# Altium schematic sheet AM3359_C.SchDoc
size A2
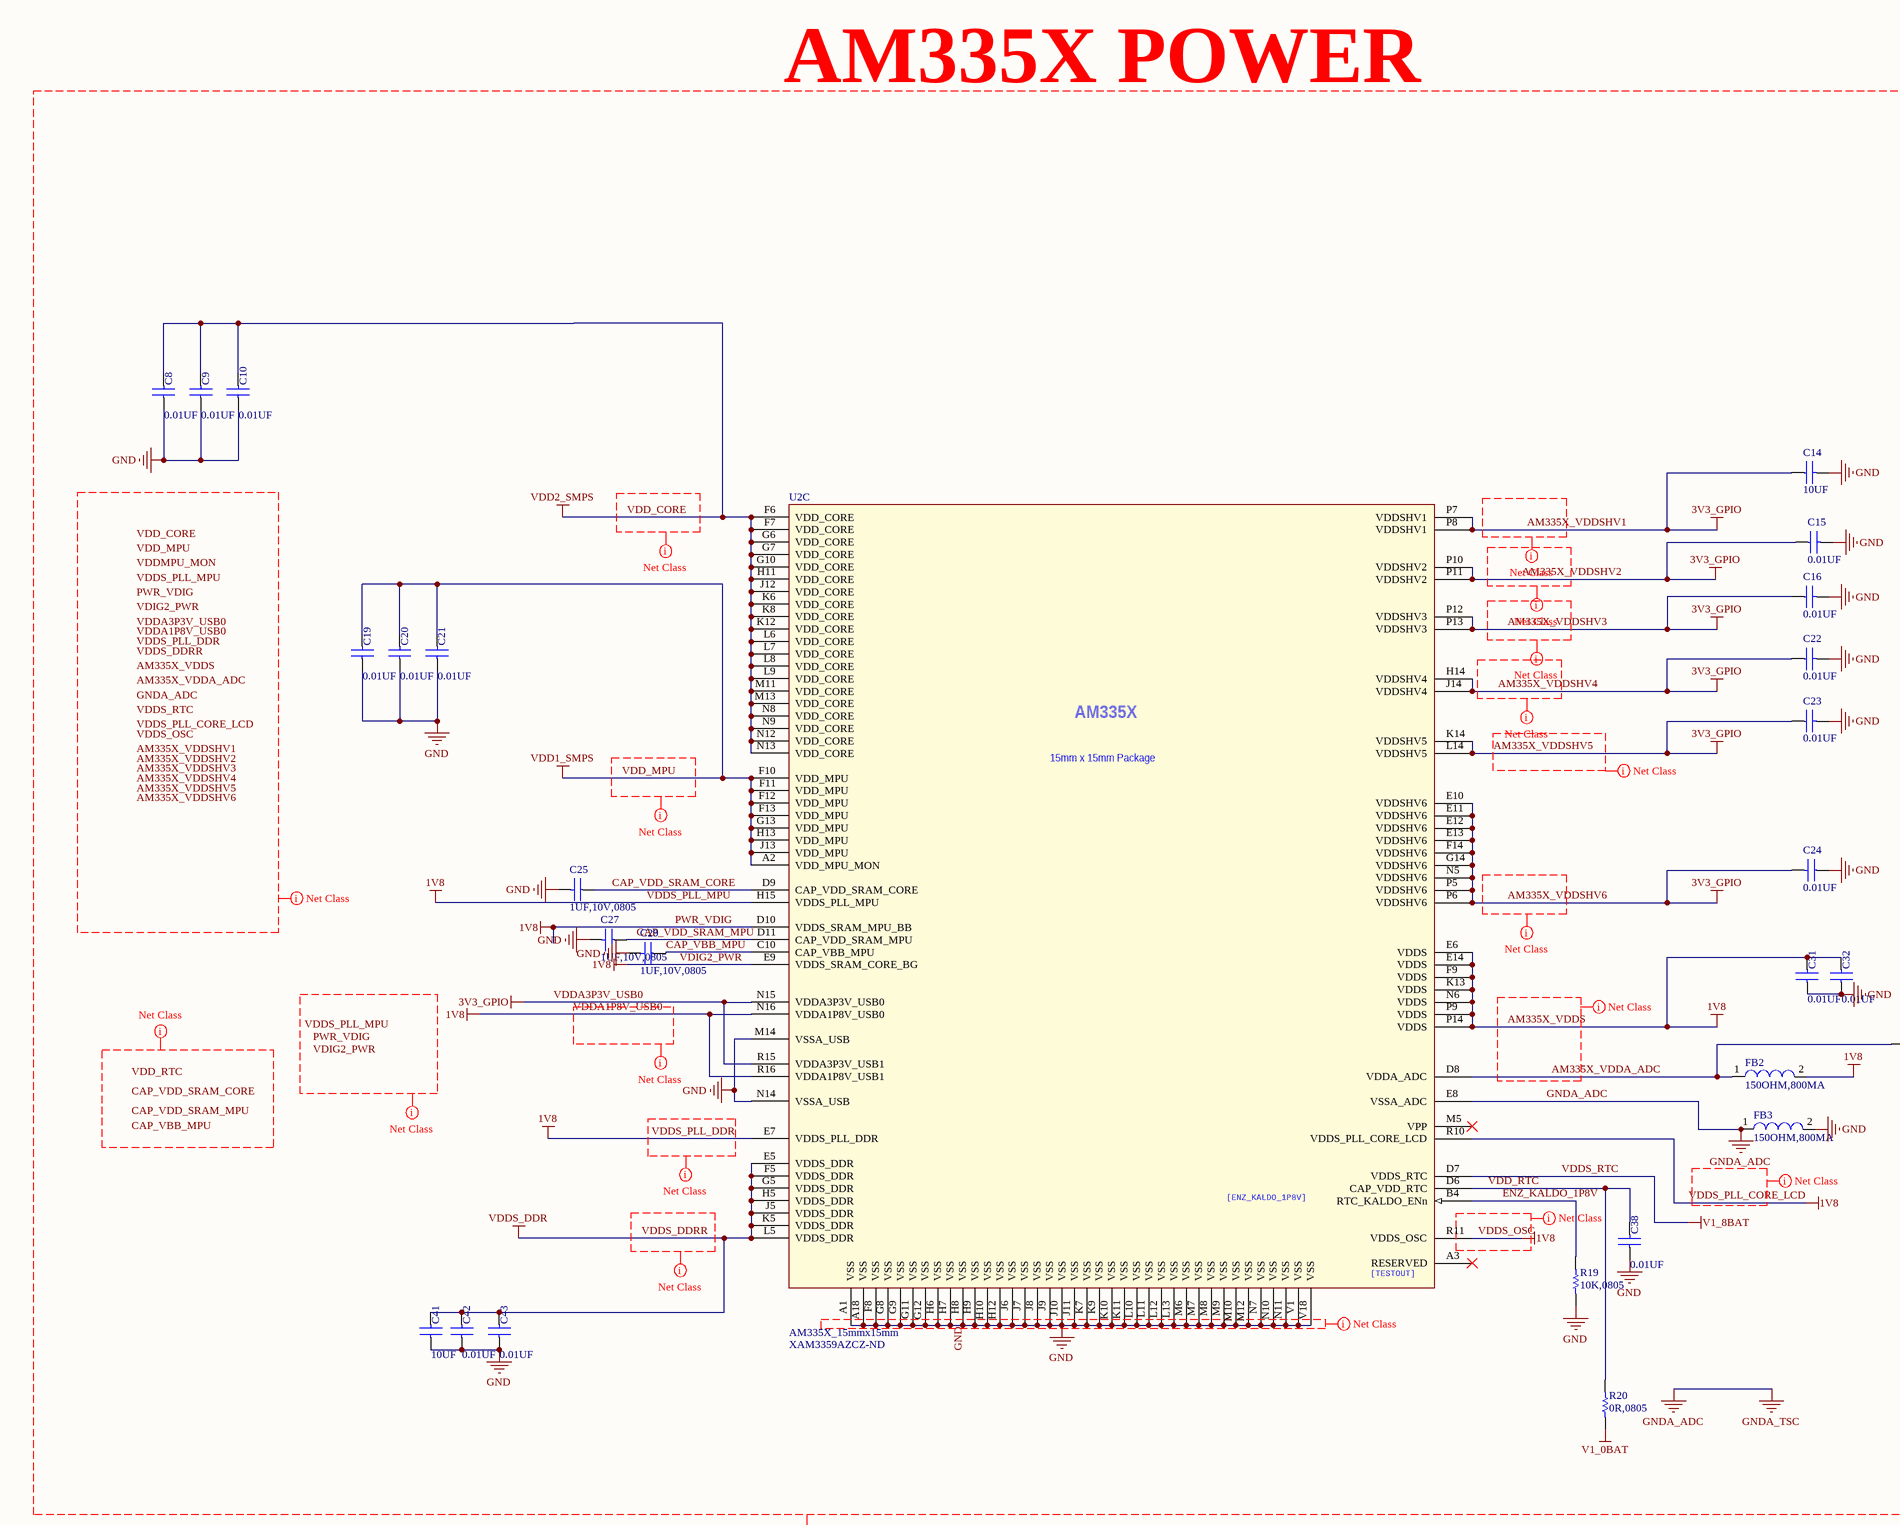
[diagram p0: AM3359_C.SchDoc, left]
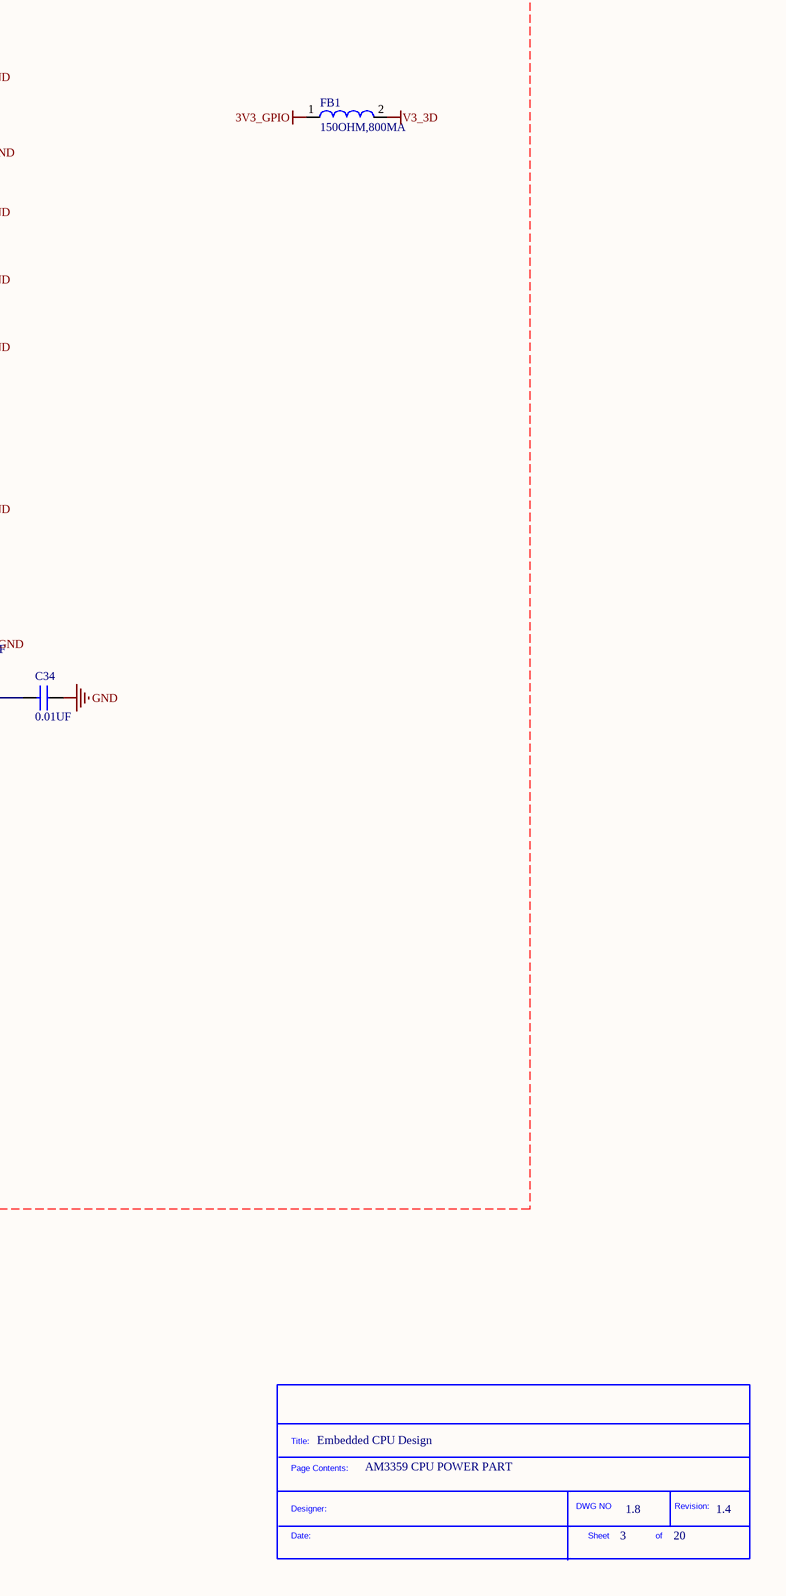
[diagram p1: AM3359_C.SchDoc, right]

## Parts
*?  SDTitleBlock  (value not drawn)  (graphical)
C8  0.01UF  [0402]
C9  0.01UF  [0402]
C10  0.01UF  [0402]
C14  10UF  [0402]
C15  0.01UF  [0402]
C16  0.01UF  [0402]
C19  0.01UF  [0402]
C20  0.01UF  [0402]
C21  0.01UF  [0402]
C22  0.01UF  [0402]
C23  0.01UF  [0402]
C24  0.01UF  [0402]
C25  1UF,10V,0805  [0402]
C27  1UF,10V,0805  [0402]
C29  1UF,10V,0805  [0402]
C31  0.01UF  [0402]
C32  0.01UF  [0402]
C34  0.01UF  [0402]
C38  0.01UF  [0402]
C41  10UF  [0402]
C42  0.01UF  [0402]
C43  0.01UF  [0402]
FB1  150OHM,800MA  [0805]
FB2  150OHM,800MA  [0805]
FB3  150OHM,800MA  [0805]
R19  10K,0805  [0402]
R20  0R,0805  [0402]
U2  AM335X_15mmx15mm  Supplier Part Number 1: XAM3359AZCZ-ND  [am33xx_15x15]  (part C of 3)

## Nets
AM335X_VDDS: C31.2 C32.2 FB2.2 U2.D10(VDDS_SRAM_MPU_BB) U2.E6(VDDS) U2.E7(VDDS_PLL_DDR) U2.E9(VDDS_SRAM_CORE_BG) U2.E14(VDDS) U2.F9(VDDS) U2.H15(VDDS_PLL_MPU) U2.K13(VDDS) U2.N6(VDDS) U2.N16(VDDA1P8V_USB0) U2.P9(VDDS) U2.P14(VDDS) U2.R10(VDDS_PLL_CORE_LCD) U2.R11(VDDS_OSC) U2.R16(VDDA1P8V_USB1)  [also labelled 1V8, PWR_VDIG, VDDA1P8V_USB0, VDDS_OSC, VDDS_PLL_CORE_LCD, VDDS_PLL_DDR, VDDS_PLL_MPU, VDIG2_PWR]
AM335X_VDDSHV1: C14.1 C15.1 C16.1 C22.1 C23.1 C24.2 FB1.1 U2.E10(VDDSHV6) U2.E11(VDDSHV6) U2.E12(VDDSHV6) U2.E13(VDDSHV6) U2.F14(VDDSHV6) U2.G14(VDDSHV6) U2.H14(VDDSHV4) U2.J14(VDDSHV4) U2.K14(VDDSHV5) U2.L14(VDDSHV5) U2.N5(VDDSHV6) U2.N15(VDDA3P3V_USB0) U2.P5(VDDSHV6) U2.P6(VDDSHV6) U2.P7(VDDSHV1) U2.P8(VDDSHV1) U2.P10(VDDSHV2) U2.P11(VDDSHV2) U2.P12(VDDSHV3) U2.P13(VDDSHV3) U2.R15(VDDA3P3V_USB1)  [also labelled 3V3_GPIO, AM335X_VDDSHV2, AM335X_VDDSHV3, AM335X_VDDSHV4, AM335X_VDDSHV5, AM335X_VDDSHV6, VDDA3P3V_USB0]
GND: C8.1 C9.1 C10.1 C14.2 C15.2 C16.2 C19.1 C20.1 C21.1 C22.2 C23.2 C24.1 C25.2 C27.2 C29.2 C31.1 C32.1 C34.1 C38.1 C41.1 C42.1 C43.1 FB3.2 R19.1 U2.A1(VSS) U2.A18(VSS) U2.F8(VSS) U2.G8(VSS) U2.G9(VSS) U2.G11(VSS) U2.G12(VSS) U2.H6(VSS) U2.H7(VSS) U2.H8(VSS) U2.H9(VSS) U2.H10(VSS) U2.H12(VSS) U2.J6(VSS) U2.J7(VSS) U2.J8(VSS) U2.J9(VSS) U2.J10(VSS) U2.J11(VSS) U2.K7(VSS) U2.K9(VSS) U2.K10(VSS) U2.K11(VSS) U2.L10(VSS) U2.L11(VSS) U2.L12(VSS) U2.L13(VSS) U2.M6(VSS) U2.M7(VSS) U2.M8(VSS) U2.M9(VSS) U2.M10(VSS) U2.M12(VSS) U2.M14(VSSA_USB) U2.N7(VSS) U2.N10(VSS) U2.N11(VSS) U2.N14(VSSA_USB) U2.V1(VSS) U2.V18(VSS)
GNDA_ADC: FB3.1 U2.E8(VSSA_ADC)  [also labelled GNDA_TSC]
V1_0BAT: R20.1
V3_3D: FB1.2
VDD_CORE: C8.2 C9.2 C10.2 U2.F6(VDD_CORE) U2.F7(VDD_CORE) U2.G6(VDD_CORE) U2.G7(VDD_CORE) U2.G10(VDD_CORE) U2.H11(VDD_CORE) U2.J12(VDD_CORE) U2.K6(VDD_CORE) U2.K8(VDD_CORE) U2.K12(VDD_CORE) U2.L6(VDD_CORE) U2.L7(VDD_CORE) U2.L8(VDD_CORE) U2.L9(VDD_CORE) U2.M11(VDD_CORE) U2.M13(VDD_CORE) U2.N8(VDD_CORE) U2.N9(VDD_CORE) U2.N12(VDD_CORE) U2.N13(VDD_CORE)  [also labelled VDD2_SMPS]
VDD_MPU: C19.2 C20.2 C21.2 U2.A2(VDD_MPU_MON) U2.F10(VDD_MPU) U2.F11(VDD_MPU) U2.F12(VDD_MPU) U2.F13(VDD_MPU) U2.G13(VDD_MPU) U2.H13(VDD_MPU) U2.J13(VDD_MPU)  [also labelled VDD1_SMPS]
VDDS_DDRR: C41.2 C42.2 C43.2 U2.E5(VDDS_DDR) U2.F5(VDDS_DDR) U2.G5(VDDS_DDR) U2.H5(VDDS_DDR) U2.J5(VDDS_DDR) U2.K5(VDDS_DDR) U2.L5(VDDS_DDR)  [also labelled VDDS_DDR]
VDDS_RTC: U2.D7(VDDS_RTC)  [also labelled V1_8BAT]
AM335X_VDDA_ADC: C34.2 FB2.1 U2.D8(VDDA_ADC)
CAP_VBB_MPU: C29.1 U2.C10(CAP_VBB_MPU)
CAP_VDD_SRAM_CORE: C25.1 U2.D9(CAP_VDD_SRAM_CORE)
CAP_VDD_SRAM_MPU: C27.1 U2.D11(CAP_VDD_SRAM_MPU)
ENZ_KALDO_1P8V: R19.2 U2.B4(RTC_KALDO_ENn)
VDD_RTC: C38.2 R20.2 U2.D6(CAP_VDD_RTC)

Not connected (* = marked no-connect by the designer): U2 A3(RESERVED)* M5(VPP)*

## Layout directives
net class VDD1_SMPS: VDD_MPU
net class VDD2_SMPS: VDD_CORE
net class VDDS_DDR: VDDS_DDRR
net class 3V3_GPIO_AM335X: 1V8, 3V3_GPIO, AM335X_VDDA_ADC, AM335X_VDDS, AM335X_VDDSHV1, AM335X_VDDSHV2, AM335X_VDDSHV3, AM335X_VDDSHV4, AM335X_VDDSHV5, AM335X_VDDSHV6, CAP_VBB_MPU, CAP_VDD_SRAM_CORE, CAP_VDD_SRAM_MPU, ENZ_KALDO_1P8V, GND, GNDA_ADC, GNDA_TSC, PWR_VDIG, V1_0BAT, V1_8BAT, V3_3D, VDD1_SMPS, VDD2_SMPS, VDD_CORE, VDD_MPU, VDD_RTC, VDDA1P8V_USB0, VDDA3P3V_USB0, VDDMPU_MON, VDDS_DDR, VDDS_DDRR, VDDS_OSC, VDDS_PLL_CORE_LCD, VDDS_PLL_DDR, VDDS_PLL_MPU, VDDS_RTC, VDIG2_PWR
net class 1V8_GPIO_AM335X: 1V8, 3V3_GPIO, AM335X_VDDA_ADC, AM335X_VDDS, AM335X_VDDSHV1, AM335X_VDDSHV2, AM335X_VDDSHV3, AM335X_VDDSHV4, AM335X_VDDSHV5, AM335X_VDDSHV6, CAP_VBB_MPU, CAP_VDD_SRAM_CORE, CAP_VDD_SRAM_MPU, ENZ_KALDO_1P8V, GND, GNDA_ADC, GNDA_TSC, PWR_VDIG, V1_0BAT, V1_8BAT, V3_3D, VDD1_SMPS, VDD2_SMPS, VDD_CORE, VDD_MPU, VDD_RTC, VDDA1P8V_USB0, VDDA3P3V_USB0, VDDMPU_MON, VDDS_DDR, VDDS_DDRR, VDDS_OSC, VDDS_PLL_CORE_LCD, VDDS_PLL_DDR, VDDS_PLL_MPU, VDDS_RTC, VDIG2_PWR
net class AM335X_C: 1V8, 3V3_GPIO, AM335X_VDDA_ADC, AM335X_VDDS, AM335X_VDDSHV1, AM335X_VDDSHV2, AM335X_VDDSHV3, AM335X_VDDSHV4, AM335X_VDDSHV5, AM335X_VDDSHV6, CAP_VBB_MPU, CAP_VDD_SRAM_CORE, CAP_VDD_SRAM_MPU, ENZ_KALDO_1P8V, GND, GNDA_ADC, GNDA_TSC, PWR_VDIG, V1_0BAT, V1_8BAT, V3_3D, VDD1_SMPS, VDD2_SMPS, VDD_CORE, VDD_MPU, VDD_RTC, VDDA1P8V_USB0, VDDA3P3V_USB0, VDDMPU_MON, VDDS_DDR, VDDS_DDRR, VDDS_OSC, VDDS_PLL_CORE_LCD, VDDS_PLL_DDR, VDDS_PLL_MPU, VDDS_RTC, VDIG2_PWR
net class GND: GND
net class CAP: CAP_VBB_MPU, CAP_VDD_SRAM_CORE, CAP_VDD_SRAM_MPU, VDD_RTC
net class PWR: AM335X_VDDA_ADC, AM335X_VDDS, AM335X_VDDSHV1, AM335X_VDDSHV2, AM335X_VDDSHV3, AM335X_VDDSHV4, AM335X_VDDSHV5, AM335X_VDDSHV6, GNDA_ADC, PWR_VDIG, VDD_CORE, VDD_MPU, VDDA1P8V_USB0, VDDA3P3V_USB0, VDDMPU_MON, VDDS_DDRR, VDDS_OSC, VDDS_PLL_CORE_LCD, VDDS_PLL_DDR, VDDS_PLL_MPU, VDDS_RTC, VDIG2_PWR

## Notes on the sheet
- AM335X POWER
- Embedded CPU Design
- AM3359 CPU POWER PART
- 3
- 1.8
- 20
- 1.4
- Labels drawn without touching a wire or pin: AM335X_VDDA_ADC, AM335X_VDDS, AM335X_VDDSHV1, AM335X_VDDSHV2, AM335X_VDDSHV3, AM335X_VDDSHV4, AM335X_VDDSHV5, AM335X_VDDSHV6, CAP_VBB_MPU, CAP_VDD_SRAM_CORE, CAP_VDD_SRAM_MPU, GNDA_ADC, PWR_VDIG, VDD_CORE, VDD_MPU, VDD_RTC, VDDA1P8V_USB0, VDDA3P3V_USB0, VDDMPU_MON, VDDS_DDRR, VDDS_OSC, VDDS_PLL_CORE_LCD, VDDS_PLL_DDR, VDDS_PLL_MPU, VDDS_RTC, VDIG2_PWR
- (in symbol AM335X_15mmx15mm, part C) AM335X; 15mm x 15mm Package; [ENZ_KALDO_1P8V]; [TESTOUT]
- (in symbol SDTitleBlock) Title:; Page Contents:; Designer:; DWG NO; Revision:; Date:; Sheet; of

## Library data of the parts
C8-C10 C15 C16 C19-C24 C31 C32 C34 C38 C42 C43 = GRM155R71C103KA01D: Multilayer Ceramic Capacitors MLCC - SMD/SMT 0402 0.01uF 16volts X7R 10%; Manufacturer: Murata Electronics; Type: General Purpose MLCC; Voltage Rating DC: 16 V; Case Height: 0.5 mm; Case Length: 1 mm; Temperature Coefficient / Code: +/- 15 %; Supplier 1: Mouser; Manufacturer Part Number: GRM155R71C103KA01D; RoHS: RoHS Compliant; Category: Multilayer Ceramic Capacitors MLCC - SMD/SMT; Stock 1: 784820; Pricing 1: 1=0.135, 10=0.009, 100=0.005, 2500=0.004, 10000=0.004, 20000=0.003 (AUD); Capacitance: 0.01 uF; Operating Temperature Range: - 55 C to + 125 C; Package / Case: 0402 (1005 metric); Packaging: Reel; Product: General Type MLCCs; Series: GRM; Termination Style: SMD/SMT; Tolerance: 10 %; Brand: Murata Electronics; Case Code - in: 0402; Case Code - mm: 1005; Case Width: 0.5 mm; Dielectric: X7R; Maximum Operating Temperature: + 125 C; Minimum Operating Temperature: - 55 C; Product Category: Low & Medium Capacitance SMD Ceramic Chip Capacitors; Standard Pack Qty: 10000; RoHS - Mouser: Y; Minimum Order Quantity: 1; Reeling: True; ComponentLink1URL: http://www.murata.com/products/catalog/pdf/c02e.pdf; ComponentLink1Description: http://www.murata.com/products/catalog/pdf/c02e.pdf; Supplier Part Number 1: 81-GRM36X103K16
C14 C41 = GRM155R60J106ME44D: Multilayer Ceramic Capacitors MLCC - SMD/SMT 10UF 6.3V 20% 0402; Manufacturer: Murata Electronics; Type: General Purpose MLCC; Case Height: 0.5 mm; Case Length: 1 mm; Dielectric: X5R; Temperature Coefficient / Code: +/- 15 %; Product Status: New at Mouser; Supplier 1: Mouser; Manufacturer Part Number: GRM155R60J106ME44D; Category: Multilayer Ceramic Capacitors MLCC - SMD/SMT; Stock 1: 560073; Pricing 1: 1=0.446, 10=0.304, 100=0.228, 500=0.224, 1000=0.216, 5000=0.208, 10000=0.157 (AUD); Capacitance: 10 uF; Operating Temperature Range: - 55 C to + 85 C; Package / Case: 0402 (1005 metric); Packaging: Reel; Product: General Type MLCCs; Series: GRM; Termination Style: SMD/SMT; Tolerance: 20 %; Voltage Rating DC: 6.3 V; Brand: Murata Electronics; Case Code - in: 0402; Case Code - mm: 1005; Case Width: 0.5 mm; Maximum Operating Temperature: + 85 C; Minimum Operating Temperature: - 55 C; Standard Pack Qty: 10000; Minimum Order Quantity: 1; Reeling: True; ComponentLink1URL: http://www.murata.com/products/catalog/pdf/c02e.pdf; ComponentLink1Description: http://www.murata.com/products/catalog/pdf/c02e.pdf; Supplier Part Number 1: 81-GRM155R60J106ME4D
C25 C27 C29 = 1UF,10V,0805: AVX - 0805ZC105JAT2A - CAP, MLCC, X7R, 1UF, 10V, 0805; Capacitance: 1; Capacitance Tolerance: ± 5%; Dielectric Characteristic: X7; Voltage Rating: 10; Ceramic Capacitor Case: 0805 [2012 Metric]; SVHC: No SVHC (16-Jun-2014); Capacitor Case Style: 0805 [2012 Metric]<!--FANDB--><div class="features-and-benefits-container"></div>; Tolerance: ±5%; Supplier 1: Digi-Key; Manufacturer: AVX; Manufacturer Part Number: 0805ZC105JAT2A; RoHS: YES; Stock 1: 13938; Pricing 1: 1=0.81, 10=0.689, 100=0.403, 250=0.338, 500=0.3055, 1000=0.2795 (USD); Product Range: -; Operating Temperature Min: -55; Operating Temperature Max: 125; Packaging: Cut Tape; MSL: MSL 1 - Unlimited; Capacitance Tolerance ±: ± 5%; ComponentLink1URL: http://www.farnell.com/datasheets/1679506.pdf; ComponentLink1Description: http://www.farnell.com/datasheets/1679506.pdf; Supplier Part Number 1: 478-6224-1-ND; Category: Capacitors; Voltage - Rated: 10V; Temperature Coefficient: X7R; Mounting Type: Surface Mount, MLCC; Operating Temperature: -55°C ~ 125°C; Applications: General Purpose; Ratings: -; Package / Case: 0805 (2012 Metric); Size / Dimension: 0.079" L x 0.049" W (2.01mm x 1.25mm); Height - Seated (Max): -; Thickness (Max): 0.055" (1.40mm); Lead Spacing: -; Features: -; Lead Style: -; ComponentLink2URL: http://www.avx.com/docs/Catalogs/cx7r.pdf; ComponentLink2Description: http://www.avx.com/docs/Catalogs/cx7r.pdf
FB1-FB3 = 150OHM,800MA: FERRITE 800MA 150 OHM 0805 SMD; Manufacturer: Laird-Signal Integrity Products; Manufacturer Part Number: LI0805H151R-10; Impedance @ Frequency: 150 Ohm @ 100MHz; DC Resistance (DCR): 150 mOhm Max; Filter Type: Differential Mode - Single; Supplier 1: Digi-Key; RoHS: RoHS Compliant; Category: Filters; Stock 1: 418596; Pricing 1: 1=0.1, 10=0.07, 25=0.064, 50=0.0574, 100=0.0421, 250=0.03064, 500=0.02808, 1000=0.02424 (USD); Packaging: Cut Tape (CT); Current Rating: 800mA; Package / Case: 0805 (2012 Metric); Mounting Type: Surface Mount; Height (Max): 0.043" (1.10mm); Size / Dimension: 0.079" L x 0.049" W (2.00mm x 1.25mm); ComponentLink1URL: http://www.lairdtech.com/WorkArea/linkit.aspx?LinkIdentifier=id&ItemID=4912; ComponentLink1Description: http://www.lairdtech.com/WorkArea/linkit.aspx?LinkIdentifier=id&ItemID=4912; Supplier Part Number 1: 240-2384-1-ND
R19 = 10K,0805: BOURNS - CR0805-FX-1002GLF - RESISTOR, 10K, 0.125W, 1%; Product Range: BOURNS - CR Series; Resistance: 10; Power Rating: 125; Resistor Case Style: 0805 [2012 Metric]; Resistor Element Material: Thick Film; Temperature Coefficient: ± 100; Voltage Rating: 150; SVHC: No SVHC (16-Jun-2014); Resistor Mounting: SMD<!--FANDB--><div class="features-and-benefits-container"></div>; Power (Watts): 0.125W, 1/8W; Supplier 1: Digi-Key; Manufacturer: BOURNS; Manufacturer Part Number: CR0805-FX-1002GLF; RoHS: YES; Stock 1: 1116166; Pricing 1: 1=0.1, 10=0.029, 50=0.0162, 100=0.0123, 250=0.00912, 500=0.00672, 1000=0.00448, 2500=0.00378 (USD); Resistance Tolerance: ± 1%; Packaging: Cut Tape; MSL: MSL 1 - Unlimited; ComponentLink1URL: http://www.farnell.com/datasheets/1845293.pdf; ComponentLink1Description: http://www.farnell.com/datasheets/1845293.pdf; Supplier Part Number 1: RMCF0805FT10K0CT-ND; Category: Resistors; Resistance (Ohms): 10k; Tolerance: ±1%; Composition: Thick Film; Features: -; Operating Temperature: -55°C ~ 155°C; Package / Case: 0805 (2012 Metric); Supplier Device Package: 0805; Size / Dimension: 0.079" L x 0.049" W (2.00mm x 1.25mm); Height: 0.026" (0.65mm); Number of Terminations: 2; ComponentLink2URL: http://www.seielect.com/Catalog/SEI-RMCF_RMCP.pdf; ComponentLink2Description: http://www.seielect.com/Catalog/SEI-RMCF_RMCP.pdf
R20 = 0R,0805: BOURNS - CR0805-J/-000ELF - RESISTOR, 0805, 0R, 5%, 1/8W; Product Range: BOURNS - CR Series; Resistance: 0; Power Rating: 125; Resistor Case Style: 0805 [2012 Metric]; Resistor Element Material: Thick Film; Temperature Coefficient: -250ppm/°C to +500; Voltage Rating: 150; SVHC: No SVHC (16-Jun-2014); Resistor Mounting: SMD<!--FANDB--><div class="features-and-benefits-container"></div>; Connector Type: RJ45; Number of Ports: 1; LED Color: Green - Yellow; Number of Cores per Jack: 6; Shielding: Shielded, EMI Finger; Tab Direction: Up; Shield Material: Brass; Resistance (Ohms): 0.0; Tolerance: Jumper; Power (Watts): 0.125W, 1/8W; Manufacturer: BOURNS; Manufacturer Part Number: CR0805-J/-000ELF; RoHS: YES; Resistance Tolerance: ± 5%; Packaging: Cut Tape; MSL: MSL 1 - Unlimited; ComponentLink1URL: http://www.farnell.com/datasheets/1845293.pdf; ComponentLink1Description: http://www.farnell.com/datasheets/1845293.pdf; Category: Connectors, Interconnects; Number of Rows: 1; Applications: 10/100 Base-T, AutoMDIX; Mounting Type: Through Hole; Orientation: 90° Angle (Right); Termination: Solder; Height Above Board: 0.555" (14.10mm); Features: Board Lock, Decoupling Capacitance; Contact Material: Phosphor Bronze; Contact Finish: Gold; Contact Finish Thickness: 50µin (1.27µm); Housing Material: Polyethylene Terephthalate (PET), Polyester; Operating Temperature: 0°C ~ 70°C; ComponentLink2URL: http://www.trpconnector.com/pdfs/6605728.pdf; ComponentLink2Description: http://www.trpconnector.com/pdfs/6605728.pdf; Supplier 1: Digi-Key; Stock 1: 1539206; Pricing 1: 1=0.1, 50=0.0196, 100=0.0149, 250=0.01104, 500=0.00816, 1000=0.00544, 2500=0.00459 (USD); Composition: Thick Film; Package / Case: 0805 (2012 Metric); Supplier Device Package: 0805; Size / Dimension: 0.079" L x 0.049" W (2.00mm x 1.25mm); Height: 0.028" (0.70mm); Number of Terminations: 2; ComponentLink3URL: http://industrial.panasonic.com/www-cgi/jvcr13pz.cgi?E+PZ+3+AOA0001+ERJ6GEY0R00V+7+WW; ComponentLink3Description: http://industrial.panasonic.com/www-cgi/jvcr13pz.cgi?E+PZ+3+AOA0001+ERJ6GEY0R00V+7+WW; Supplier Part Number 1: P0.0ACT-ND
U2 = AM335X_15mmx15mm: SubArctic Cortex A8 Processor 15x15; PartName: AM335X_15x15; Mfr: TI; MfrNum: AM335x 15x15 FBGA ZCE; TIIntPartnumber: 1A0242; Vendor: Arrow; Cost100: 10.00; Cost10K: 10.00; Supplier 1: Digi-Key